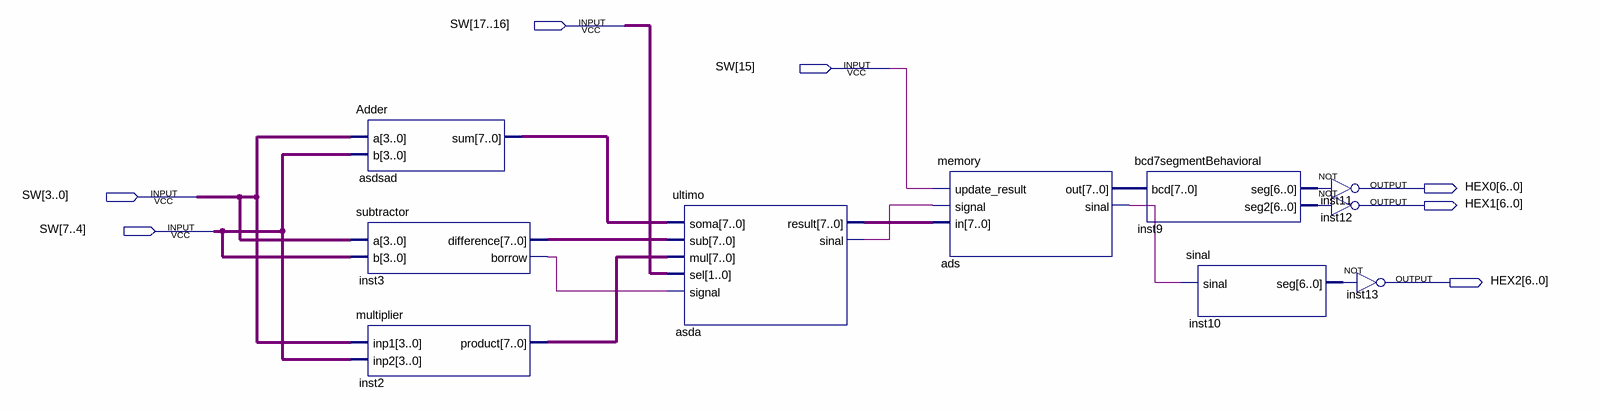
[diagram p0: schematic sheet]
// Quartus schematic PFA6.bdf as structural Verilog: 10 symbols, 7 pins
module PFA6 (
  input  [17:0] SW,
  output [6:0] HEX0,
  output [6:0] HEX1,
  output [6:0] HEX2
);

  wire ads_sinal, asda_sinal, inst3_borrow;
  wire [6:0] inst9_seg, inst9_seg2, inst10_seg;
  wire [7:0] ads_out, asda_result, asdsad_sum, inst2_product, inst3_difference;

  Adder asdsad (.a(SW[3:0]), .b(SW[7:4]), .sum(asdsad_sum));
  subtractor inst3 (.a(SW[3:0]), .b(SW[7:4]), .difference(inst3_difference), .borrow(inst3_borrow));
  multiplier inst2 (.inp1(SW[3:0]), .inp2(SW[7:4]), .product(inst2_product));
  ultimo asda (
    .soma(asdsad_sum), .sub(inst3_difference), .mul(inst2_product), .sel(SW[17:16]), .signal(inst3_borrow),
    .result(asda_result), .sinal(asda_sinal));
  memory ads (.update_result(SW[15]), .signal(asda_sinal), .in(asda_result), .out(ads_out), .sinal(ads_sinal));
  bcd7segmentBehavioral inst9 (.bcd(ads_out), .seg(inst9_seg), .seg2(inst9_seg2));
  sinal inst10 (.sinal(ads_sinal), .seg(inst10_seg));
  assign HEX0 = ~inst9_seg;  // NOT inst11, 7 bits wide
  assign HEX1 = ~inst9_seg2;  // NOT inst12, 7 bits wide
  assign HEX2 = ~inst10_seg;  // NOT inst13, 7 bits wide
endmodule
